# Altium schematic sheet Sheet1.SchDoc
size A4
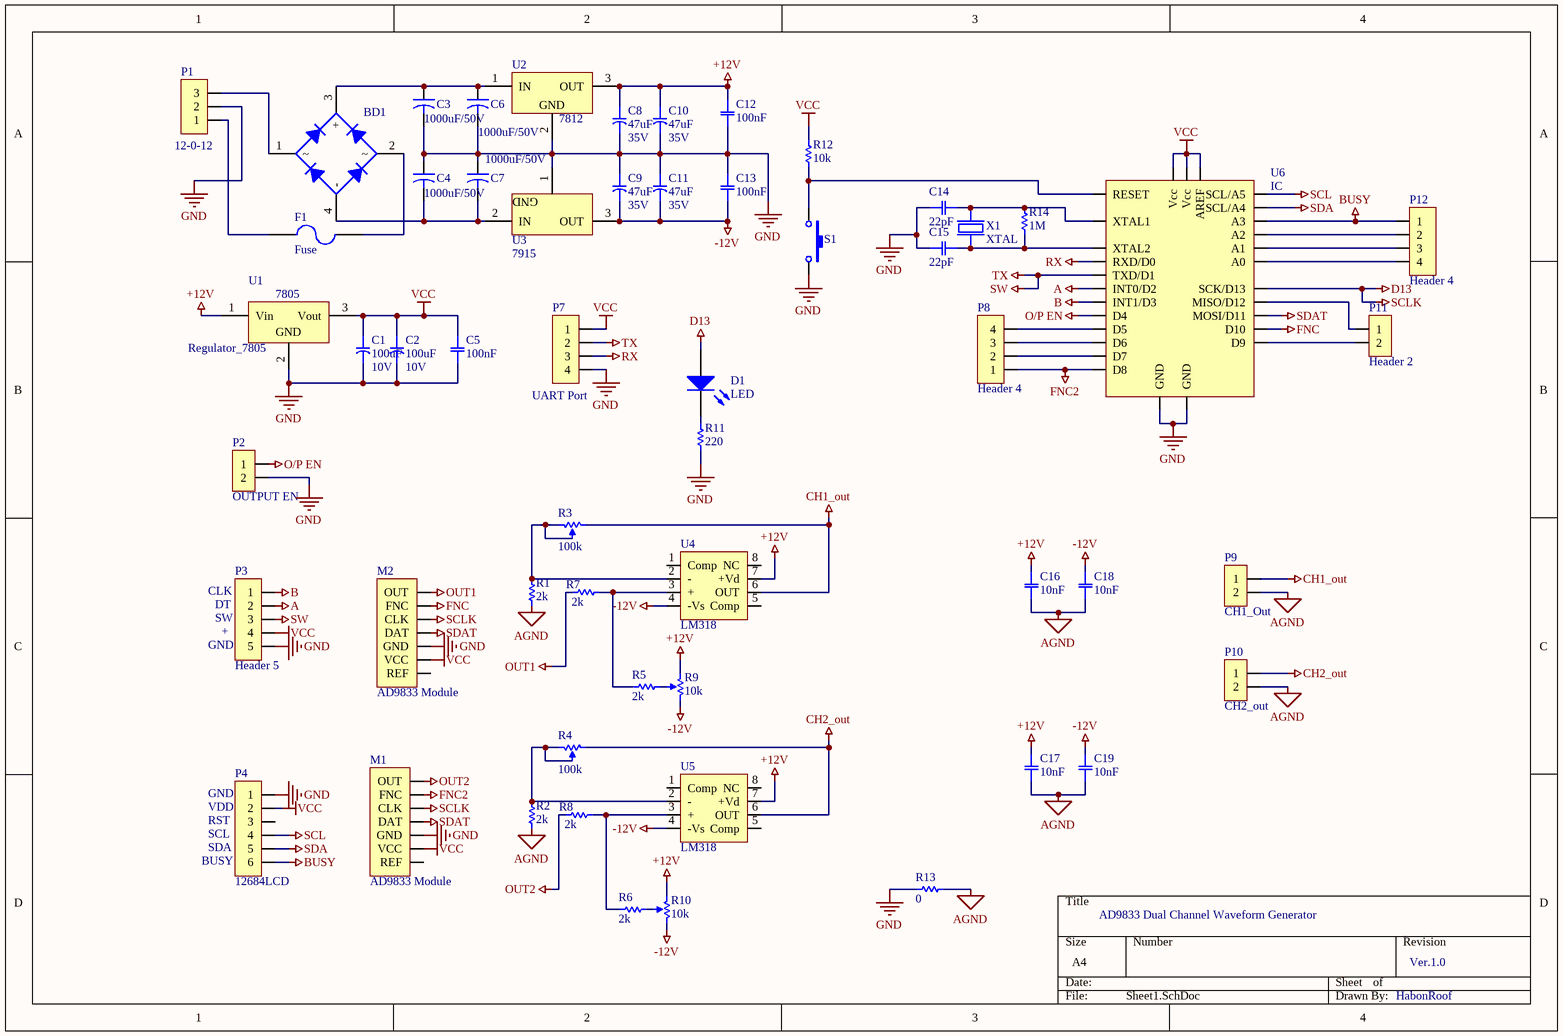
[diagram p0: Sheet1.SchDoc]

## Parts
BD1  Bridge  [Bridge_KBL406]  (value not drawn)
C1  value 100uF  Voltatge: 10V  [RAD-100_200]  (hidden comment: JACKON LHK 100uF/10V)
C2  value 100uF  Voltatge: 10V  [RAD-100_200]  (hidden comment: JACKON LHK 100uF/10V)
C3  1000uF/50V  [Cap_M_1000uF/50V]
C4  1000uF/50V  [Cap_M_1000uF/50V]
C5  value 100nF  [CAP-200_100*300]  (hidden comment: 100n/100V)
C6  1000uF/50V  [Cap_M_1000uF/50V]
C7  1000uF/50V  [Cap_M_1000uF/50V]
C8  value 47uF  Voltatge: 35V  [RAD-100_200]  (hidden comment: JACKON LHK 47uF/35V)
C9  value 47uF  Voltatge: 35V  [RAD-100_200]  (hidden comment: JACKON LHK 47uF/35V)
C10  value 47uF  Voltatge: 35V  [RAD-100_200]  (hidden comment: JACKON LHK 47uF/35V)
C11  value 47uF  Voltatge: 35V  [RAD-100_200]  (hidden comment: JACKON LHK 47uF/35V)
C12  value 100nF  [CAP-200_100*300]  (hidden comment: 100n/100V)
C13  value 100nF  [CAP-200_100*300]  (hidden comment: 100n/100V)
C14  value 22pF  [CAP-200_100*300]  (hidden comment: 22p/1kV)
C15  value 22pF  [CAP-200_100*300]  (hidden comment: 22p/1kV)
C16  value 10nF  [CAP-200_100*300]  (hidden comment: 100n/100V)
C17  value 10nF  [CAP-200_100*300]  (hidden comment: 100n/100V)
C18  value 10nF  [CAP-200_100*300]  (hidden comment: 100n/100V)
C19  value 10nF  [CAP-200_100*300]  (hidden comment: 100n/100V)
D1  LED  [LED_SMALL]
F1  Fuse  [FUSE]
M1  AD9833 Module  [AD9833]
M2  AD9833 Module  [AD9833]
P1  12-0-12  [HDR1X3]
P2  OUTPUT EN  [HDR1X2]
P3  Header 5  [HDR1X5]
P4  12684LCD  [HDR1X6]
P7  UART Port  [HDR1X4H]
P8  Header 4  [HDR1X4]
P9  CH1_Out  [HDR1X2]
P10  CH2_out  [HDR1X2]
P11  Header 2  [HDR1X2]
P12  Header 4  [HDR1X4]
R1  2k  [R-0.25W]
R2  2k  [R-0.25W]
R3  100k  [VR-Medium]
R4  100k  [VR-Medium]
R5  2k  [R-0.25W]
R6  2k  [R-0.25W]
R7  2k  [R-0.25W]
R8  2k  [R-0.25W]
R9  10k  [VR-Medium]
R10  10k  [VR-Medium]
R11  220  [RS0805]
R12  10k  [R-0.25W]
R13  0  [RS0805]
R14  1M  [R-0.25W]
S1  SW PB  [Button]  (value not drawn)
U1  Regulator_7805  [TO-220]
U2  7812  [TO-220]
U3  7915  [TO-220]
U4  LM318  [DIP-8]
U5  LM318  [DIP-8]
U6  IC  [DIP-28]
X1  XTAL  [HC49-4H]

## Nets
+12V: C8.1 C10.1 C12.2 C16.1 C17.1 R9.3 R10.3 U1.1(Vin) U2.3(OUT) U4.7(+Vd) U5.7(+Vd)
-12V: C9.2 C11.2 C13.1 C18.2 C19.2 R9.1 R10.1 U3.3(OUT) U4.4(-Vs) U5.4(-Vs)
A: P3.2 U6.4(INT0/D2)
AGND: C16.2 C17.2 C18.1 C19.1 P9.2 P10.2 R1.2 R2.2 R13.1
B: P3.1 U6.5(INT1/D3)
BUSY: P4.6 P12.1 U6.26(A3)
CH1_out: P9.1 R3.1 U4.6(OUT)
CH2_out: P10.1 R4.1 U5.6(OUT)
D13: D1.1(A) M1.5(CLK) M2.5(CLK) U6.19(SCK/D13)  [also labelled SCLK]
FNC: M2.6(FNC) U6.16(D10)
FNC2: M1.6(FNC) P8.1 U6.14(D8)
GND: C1.2 C2.2 C3.2 C4.1 C5.1 C6.2 C7.1 C8.2 C9.1 C10.2 C11.1 C12.1 C13.2 C14.1 C15.1 M1.3(GND) M2.3(GND) P1.2 P2.2 P3.5 P4.1 P7.4 R11.2 R13.2 S1.2 U1.2(GND) U2.2(GND) U3.1(GND) U6.8(GND) U6.22(GND)
O/P EN: P2.1 U6.6(D4)
OUT1: M2.7(OUT) R7.2
OUT2: M1.7(OUT) R8.2
RX: P7.3 U6.2(RXD/D0)
SCL: P4.4 U6.28(SCL/A5)
SDA: P4.5 U6.27(SCL/A4)
SDAT: M1.4(DAT) M2.4(DAT) U6.17(MOSI/D11)
SW: P3.3 P7.2 U6.3(TXD/D1)  [also labelled TX]
VCC: C1.1 C2.1 C5.2 M1.2(VCC) M2.2(VCC) P3.4 P4.2 P7.1 R12.2 U1.3(Vout) U6.7(Vcc) U6.20(Vcc) U6.21(AREF)
NetBD1_1: BD1.1 P1.3
NetBD1_2: BD1.2 F1.2
NetBD1_3: BD1.3(+) C3.1 C6.1 U2.1(IN)
NetBD1_4: BD1.4(-) C4.2 C7.2 U3.2(IN)
NetC14_2: C14.2 R14.1 U6.9(XTAL1) X1.1
NetC15_2: C15.2 R14.2 U6.10(XTAL2) X1.2
NetD1_2: D1.2(K) R11.1
NetF1_1: F1.1 P1.1
NetP8_2: P8.2 U6.13(D7)
NetP8_3: P8.3 U6.12(D6)
NetP8_4: P8.4 U6.11(D5)
NetP11_1: P11.1 U6.18(MISO/D12)
NetP11_2: P11.2 U6.15(D9)
NetP12_2: P12.2 U6.25(A2)
NetP12_3: P12.3 U6.24(A1)
NetP12_4: P12.4 U6.23(A0)
NetR1_1: R1.1 R3.2 R3.3 U4.2(-)
NetR2_1: R2.1 R4.2 R4.3 U5.2(-)
NetR5_1: R5.1 R7.1 U4.3(+)
NetR5_2: R5.2 R9.2
NetR6_1: R6.1 R8.1 U5.3(+)
NetR6_2: R6.2 R10.2
NetR12_1: R12.1 S1.1 U6.1(RESET)

Not connected (* = marked no-connect by the designer): M1 1(REF); M2 1(REF); P4 3; U4 1(Comp) 5(Comp) 8(NC); U5 1(Comp) 5(Comp) 8(NC)

## Notes on the sheet
- (near P3) CLK
- (near P3) GND
- (near P3) DT
- (near P3) SW
- (near P3) +
- (near P4) GND
- (near P4) VDD
- (near P4) RST
- (near P4) SCL
- (near P4) SDA
- (near P4) BUSY
- AD9833 Dual Channel Waveform Generator
- Ver.1.0
- HabonRoof
- (in symbol Regulator-7805) 7805

## Library data of the parts
BD1 = Bridge: 全波整流器; Published: 8-Jun-2000; Revision: July-2002: Re-released for DXP Platform.; Publisher: Altium Limited
C1 C2 = JACKON LHK 100uF/10V: JACKON LHK General Purpose; Published: 8-Jun-2000; LatestRevisionDate: 17-Jul-2002; LatestRevisionNote: Re-released for DXP Platform.; PackageReference: RB7.6-15; Publisher: Altium Limited
C3 C4 C6 C7 = Cap_EC_Medium: 有極性電解電容(中); Published: 23-Sep-2002; Publisher: Altium Limited; Value: 1000uF/50V
C5 C12 C13 C16-C19 = 100n/100V: Metallized Polyester Film Capacitor; Voltatge: 100V; Published: 8-Jun-2000; LatestRevisionDate: 17-Jul-2002; LatestRevisionNote: Re-released for DXP Platform.; PackageReference: RAD-0.3; Publisher: Altium Limited
C8-C11 = JACKON LHK 47uF/35V: JACKON LHK General Purpose; Published: 8-Jun-2000; LatestRevisionDate: 17-Jul-2002; LatestRevisionNote: Re-released for DXP Platform.; PackageReference: RB7.6-15; Publisher: Altium Limited
C14 C15 = 22p/1kV: Ceramic Capacitor; Voltatge: 1kV; Published: 8-Jun-2000; LatestRevisionDate: 17-Jul-2002; LatestRevisionNote: Re-released for DXP Platform.; PackageReference: RAD-0.3; Publisher: Altium Limited
P1 = Header 3: Header, 3-Pin; LatestRevisionDate: 17-Jul-2002; LatestRevisionNote: Re-released for DXP Platform.; Publisher: Altium Limited
P2 P9-P11 = Header 2: Header, 2-Pin; LatestRevisionDate: 17-Jul-2002; LatestRevisionNote: Re-released for DXP Platform.; Publisher: Altium Limited
P3 = Header 5: Header, 5-Pin; LatestRevisionDate: 17-Jul-2002; LatestRevisionNote: Re-released for DXP Platform.; Publisher: Altium Limited
P4 = Header 6: Header, 6-Pin; LatestRevisionDate: 17-Jul-2002; LatestRevisionNote: Re-released for DXP Platform.; Publisher: Altium Limited
P7 P8 P12 = Header 4: Header, 4-Pin; LatestRevisionDate: 17-Jul-2002; LatestRevisionNote: Re-released for DXP Platform.; Publisher: Altium Limited
R1 R2 R5-R8 R11-R14 = Resistor: 固定電阻; Published: 8-Jun-2000; LatestRevisionDate: 17-Jul-2002; LatestRevisionNote: Re-released for DXP Platform.; PackageReference: AXIAL-0.5; Publisher: Altium Limited; PackageDescription: Axial Device, Thru-Hole; 2 Leads; 0.5 in Pin Spacing
R3 R4 R9 R10 = Resistor_Potentiometer: 可變電阻; Set Position: 0.5; Published: 8-Jun-2000; Revision: July-2002: Re-released for DXP Platform.; Publisher: Altium Limited
  R3 R4: Value: 100k
  R9 R10: Value: 10k
S1 = SW PB: Button Switch
U1 = Regulator-7805: Voltage Regulator; Published: 24-Mar-1999; LatestRevisionDate: 17-Jul-2002; LatestRevisionNote: Re-released for DXP Platform.; PackageReference: D2PAK; Publisher: Altium Limited; Code_JEDEC: SMD-220
U2 = 7805: THREE TERMINAL POSITIVE VOLTAGE REGULATORS
U3 = 7915: THREE TERMINAL NEGATIVE VOLTAGE REGULATORS
U4 U5 = LM318: Single OPA SR:50v/uS
U6 = Atmega328P: Arduino controller
X1 = XTAL: Crystal Oscillator
D1 = LED: Published: 8-Jun-2000; LatestRevisionDate: 08-Jul-2005; LatestRevisionNote: Mech Layer 1 removed.; PackageReference: LED-0; Publisher: Altium Limited; PackageDescription: LED; 2 Leads
F1 = Fuse: Published: 8-Jun-2000; LatestRevisionDate: 17-Jul-2002; LatestRevisionNote: Re-released for DXP Platform.; PackageReference: PIN-W2/E2.8; Publisher: Altium Limited